# EAGLE design PanoBoardV4 (EAGLE 9.2.2)
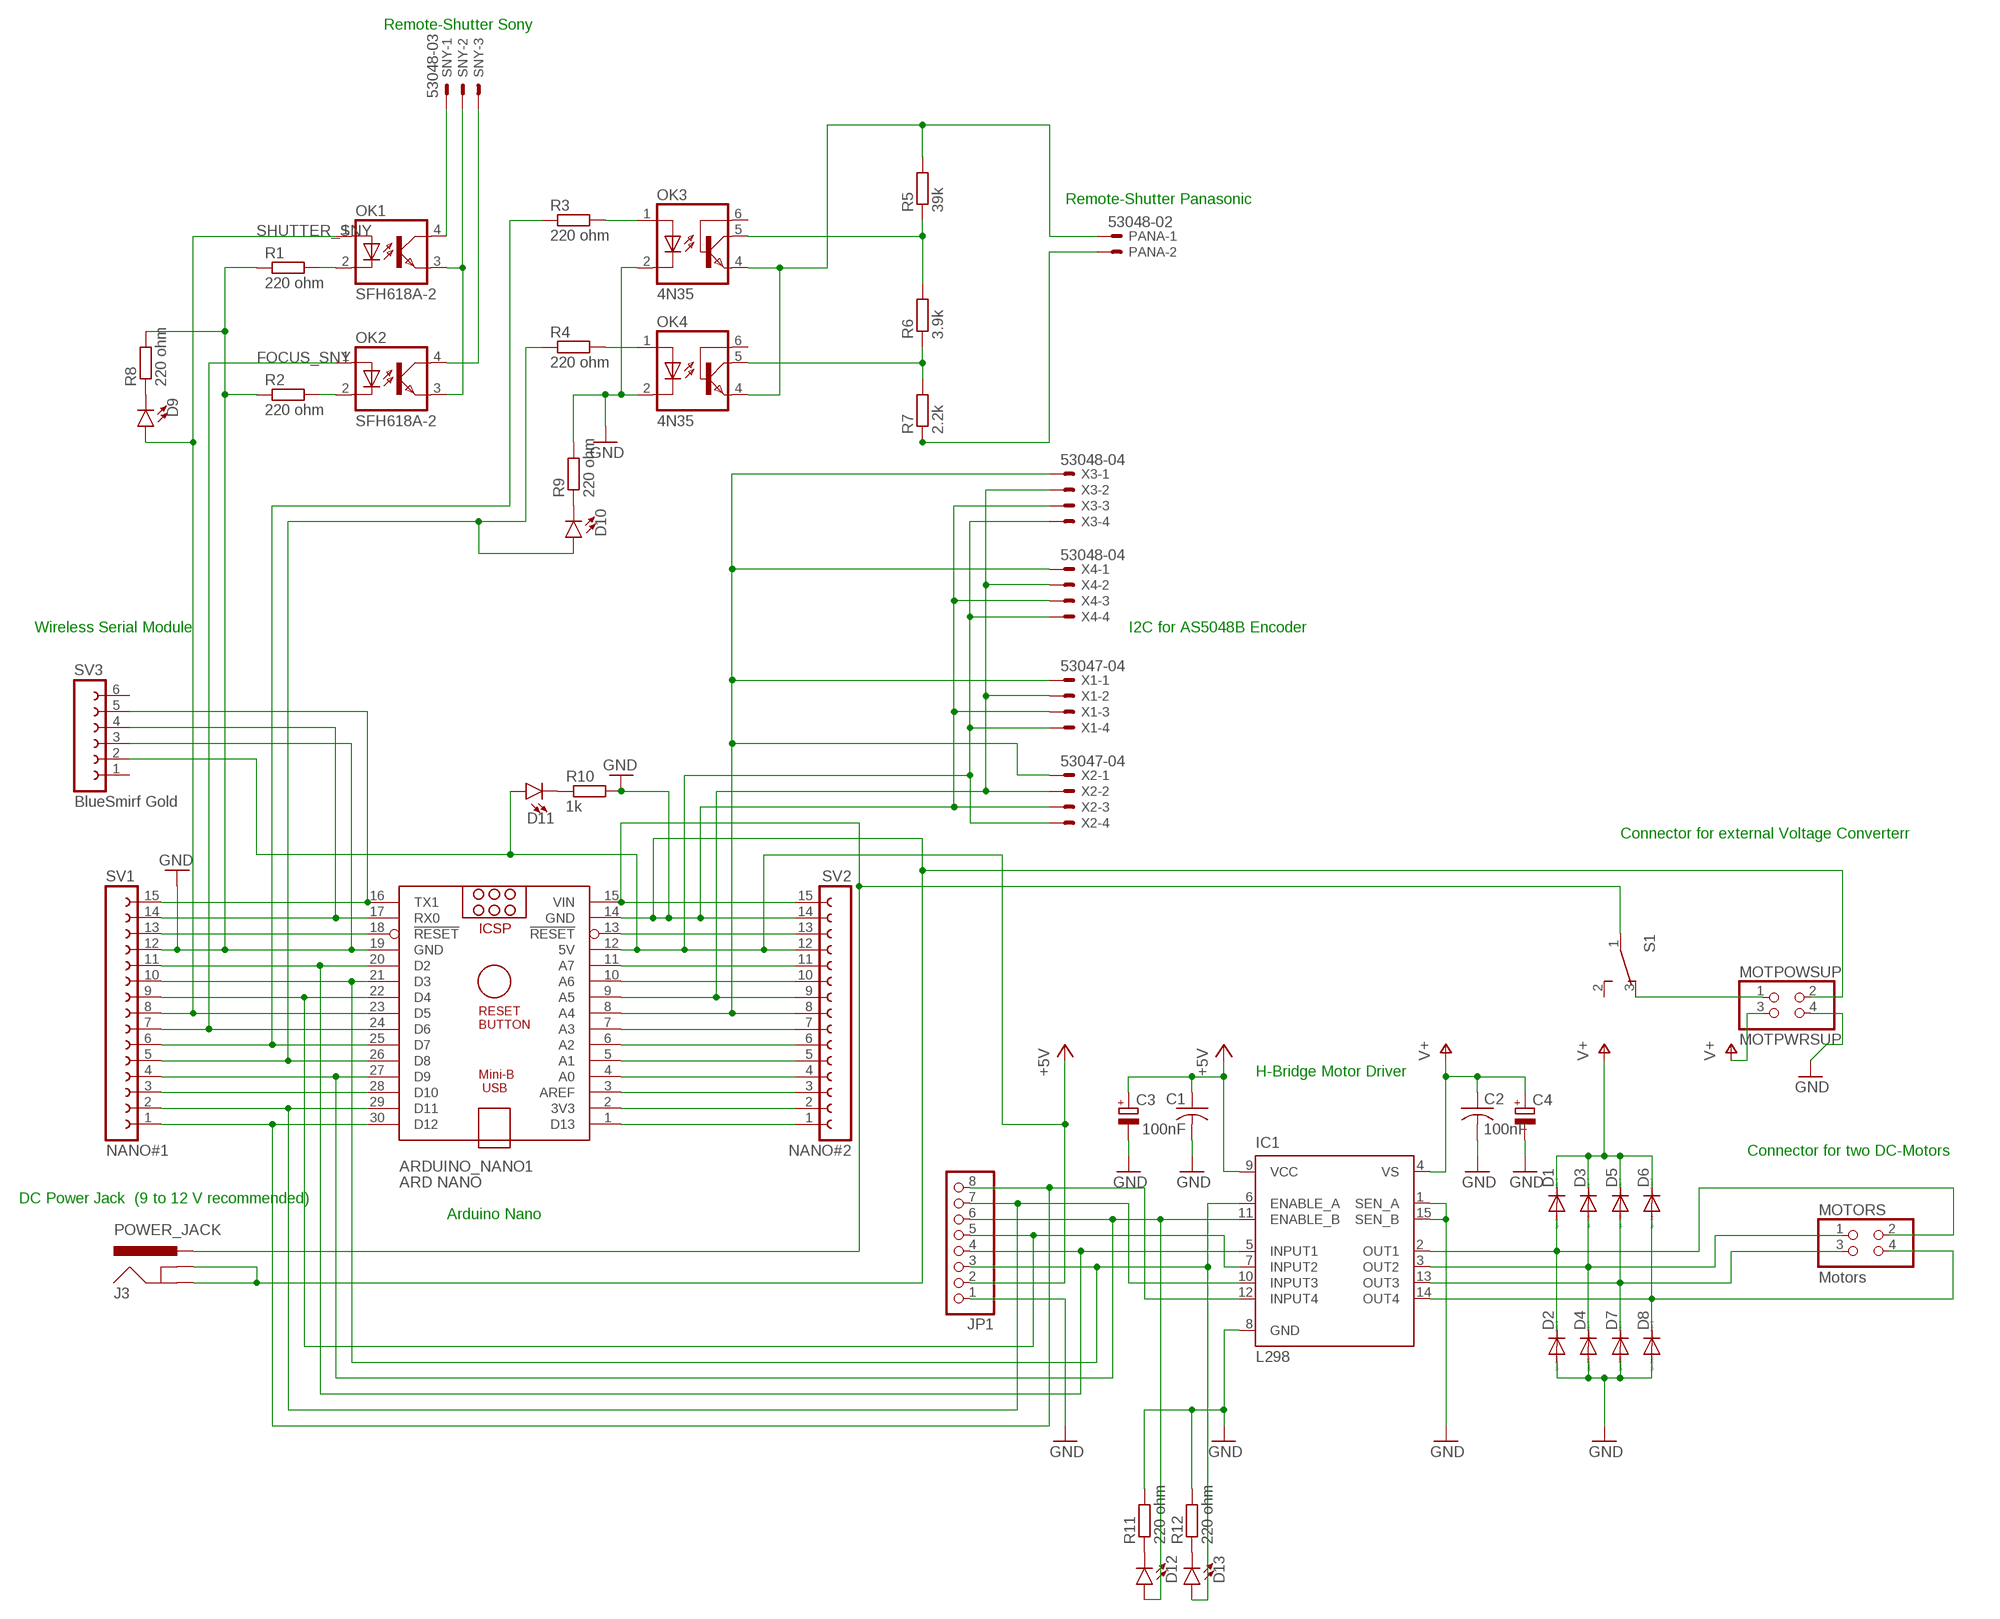
[diagram p0: schematic, sheet 1]

## Parts
ARDUINO_NANO1  ARD NANO  ARDUINO_NANO  [ARDUINO_NANO]
C1  100nF  C-US050-024X044  [C050-024X044]
C2  100nF  C-US050-024X044  [C050-024X044]
C3  CPOL-EUE3.5-10  [E3,5-10]
C4  CPOL-EUE3.5-10  [E3,5-10]
D1  DIODE-D-5  [D-5]
D2  DIODE-D-5  [D-5]
D3  DIODE-D-5  [D-5]
D4  DIODE-D-5  [D-5]
D5  DIODE-D-5  [D-5]
D6  DIODE-D-5  [D-5]
D7  DIODE-D-5  [D-5]
D8  DIODE-D-5  [D-5]
D9  LED1206  [LED-1206]
D10  LED1206  [LED-1206]
D11  LED1206  [LED-1206]
D12  LED1206  [LED-1206]
D13  LED1206  [LED-1206]
IC1  L298  [MULTIWATT-15]
J3  POWER_JACK  [POWER_JACK_PTH]
JP1  PINHD-1X8  [1X08]
MOTORS  Motors  PINHD-2X2  [2X02]
MOTPOWSUP  MOTPWRSUP  PINHD-2X2  [2X02]
OK1  SFH618A-2  [DIP4]
OK2  SFH618A-2  [DIP4]
OK3  4N35  [DIL06]
OK4  4N35  [DIL06]
PANA  53048-02  [53048-02]
R1  220 ohm  R-EU_R1210  [R1210]
R2  220 ohm  R-EU_R1210  [R1210]
R3  220 ohm  R-EU_R1210  [R1210]
R4  220 ohm  R-EU_R1210  [R1210]
R5  39k  R-EU_R1210  [R1210]
R6  3.9k  R-EU_R1210  [R1210]
R7  2.2k  R-EU_R1210  [R1210]
R8  220 ohm  R-EU_R1210  [R1210]
R9  220 ohm  R-EU_R1210  [R1210]
R10  1k  R-EU_R1210  [R1210]
R11  220 ohm  R-EU_R1210  [R1210]
R12  220 ohm  R-EU_R1210  [R1210]
S1  450302014072  [450302014072]
SNY  53048-03  [53048-03]
SV1  NANO#1  FE15-1  [FE15]
SV2  NANO#2  FE15-1  [FE15]
SV3  BlueSmirf Gold  FE06W  [FE06W]
X1  53047-04  [53047-04]
X2  53047-04  [53047-04]
X3  53048-04  [53048-04]
X4  53048-04  [53048-04]

## Nets
+5V [power5v]: ARDUINO_NANO1.12(5V) C1.1 C3.+ D11.A IC1.9(VCC) JP1.2 SV2.12 SV3.2 X1.4 X2.4 X3.4 X4.4
FOCUS_SNY: ARDUINO_NANO1.24(D6) OK2.1(A) SV1.7
GND [power]: ARDUINO_NANO1.14(GND) ARDUINO_NANO1.19(GND) C1.2 C2.2 C3.- C4.- D2.A D4.A D7.A D8.A IC1.1(SEN_A) IC1.8(GND) IC1.15(SEN_B) J3.GND J3.GNDBREAK JP1.1 MOTPOWSUP.2 MOTPOWSUP.4 OK3.2(C) OK4.2(C) R1.1 R2.1 R8.2 R9.2 R10.2 R11.2 R12.2 SV1.12 SV2.14 SV3.3 X1.3 X2.3 X3.3 X4.3
N$1: ARDUINO_NANO1.16(TX1) SV1.15 SV3.5
N$2: ARDUINO_NANO1.17(RX0) SV1.14 SV3.4
N$3: ARDUINO_NANO1.18(!RESET) SV1.13
N$4 [signal]: OK1.2(C) R1.2
N$5: ARDUINO_NANO1.20(D2) IC1.5(INPUT1) JP1.4 SV1.11
N$6: ARDUINO_NANO1.21(D3) D13.A IC1.6(ENABLE_A) JP1.3 SV1.10
N$7: ARDUINO_NANO1.22(D4) IC1.7(INPUT2) JP1.5 SV1.9
N$8 [signal]: OK1.3(EMIT) OK2.3(EMIT) SNY.2
N$9 [signal]: OK1.4(COL) SNY.1
N$10: ARDUINO_NANO1.25(D7) R3.1 SV1.6
N$11: ARDUINO_NANO1.26(D8) D10.A R4.1 SV1.5
N$12: ARDUINO_NANO1.27(D9) D12.A IC1.11(ENABLE_B) JP1.6 SV1.4
N$13: ARDUINO_NANO1.28(D10) SV1.3
N$14: ARDUINO_NANO1.29(D11) IC1.10(INPUT3) JP1.7 SV1.2
N$15: ARDUINO_NANO1.30(D12) IC1.12(INPUT4) JP1.8 SV1.1
N$16 [power]: ARDUINO_NANO1.15(VIN) J3.PWR S1.1 SV2.15
N$17 [signal]: OK2.2(C) R2.2
N$18: ARDUINO_NANO1.13(!RESET) SV2.13
N$19 [signal]: OK3.1(A) R3.2
N$20: ARDUINO_NANO1.11(A7) SV2.11
N$21: ARDUINO_NANO1.10(A6) SV2.10
N$22: ARDUINO_NANO1.9(A5) SV2.9 X1.2 X2.2 X3.2 X4.2
N$23: ARDUINO_NANO1.8(A4) SV2.8 X1.1 X2.1 X3.1 X4.1
N$24: ARDUINO_NANO1.7(A3) SV2.7
N$25: ARDUINO_NANO1.6(A2) SV2.6
N$26: ARDUINO_NANO1.5(A1) SV2.5
N$27: ARDUINO_NANO1.4(A0) SV2.4
N$28: ARDUINO_NANO1.3(AREF) SV2.3
N$29: ARDUINO_NANO1.2(3V3) SV2.2
N$30: ARDUINO_NANO1.1(D13) SV2.1
N$31 [motor]: D1.A D2.C IC1.2(OUT1) MOTORS.2
N$32 [motor]: D3.A D4.C IC1.3(OUT2) MOTORS.1
N$33 [motor]: D6.A D8.C IC1.14(OUT4) MOTORS.4
N$34 [motor]: D5.A D7.C IC1.13(OUT3) MOTORS.3
N$35 [signal]: OK4.1(A) R4.2
N$36 [signal]: OK2.4(COL) SNY.3
N$37 [signal]: OK3.5(COL) R5.1 R6.2
N$38 [signal]: OK3.4(EMI) OK4.4(EMI) PANA.1 R5.2
N$39 [signal]: OK4.5(COL) R6.1 R7.2
N$40 [power]: D9.C R8.1
N$41 [signal]: PANA.2 R7.1
N$42 [power]: D10.C R9.1
N$43 [power]: D11.C R10.1
N$44 [power]: MOTPOWSUP.1 S1.3
N$45 [power]: D12.C R11.1
N$46 [power]: D13.C R12.1
SHUTTER_SNY: ARDUINO_NANO1.23(D5) D9.A OK1.1(A) SV1.8
V+ [power]: C2.1 C4.+ D1.C D3.C D5.C D6.C IC1.4(VS) MOTPOWSUP.3
Unconnected: OK3.6(BAS) OK4.6(BAS) S1.2 SV3.1 SV3.6

## Notes on the sheet
- Remote-Shutter Sony
- Remote-Shutter Panasonic
- Wireless Serial Module | I2C for AS5048B Encoder
- Connector for external Voltage Converterr
- H-Bridge Motor Driver
- Connector for two DC-Motors
- DC Power Jack  (9 to 12 V recommended)
- Arduino Nano

## Library data of the parts
ARDUINO_NANO1 = ArduinoNanoV30:ARDUINO_NANO: Arduino Nano V3.0 Overview: The Arduino Nano is a small, complete, and breadboard-friendly board based on the ATmega328 (Arduino Nano 3.x) or ATmega168 (Arduino Nano 2.x). It has more or less the same functionality of the Arduino Duemilanove, but in a different package. It lacks only a DC power jack, and works with a Mini-B USB cable instead of a standard one. The Nano was designed and is being produced by Gravitech. Specifications: Microcontroller Atmel ATmega168 or ATmega328 Operating Voltage (logic level) 5 V Input Voltage (recommended) 7-12 V Input Voltage (limits) 6-20 V Digital I/O Pins 14 (of which 6 provide PWM output) Analog Input Pins 8 DC Current per I/O Pin 40 mA Flash Memory 16 KB (ATmega168) or 32 KB (ATmega328) of which 2 KB used by bootloader SRAM 1 KB (ATmega168) or 2 KB (ATmega328) EEPROM 512 bytes (ATmega168) or 1 KB (ATmega328) Clock Speed 16 MHz Dimensions 0.73" x 1.70" Length 45 mm Width 18 mm Weigth 5 g Power: The Arduino Nano can be powered via the Mini-B USB connection, 6-20V unregulated external power supply (pin 30), or 5V regulated external power supply (pin 27). The power source is automatically selected to the highest voltage source. Memory: The ATmega168 has 16 KB of flash memory for storing code (of which 2 KB is used for the bootloader); the ATmega328 has 32 KB, (also with 2 KB used for the bootloader). The ATmega168 has 1 KB of SRAM and 512 bytes of EEPROM (which can be read and written with the EEPROM library); the ATmega328 has 2 KB of SRAM and 1 KB of EEPROM. Input and Output: Each of the 14 digital pins on the Nano can be used as an input or output, using pinMode(), digitalWrite(), and digitalRead() functions. They operate at 5 volts. Each pin can provide or receive a maximum of 40 mA and has an internal pull-up resistor (disconnected by default) of 20-50 kOhms. In addition, some pins have specialized functions. Visit Arduino - ArduinoBoardNano <https://www.arduino.cc/en/Main/ArduinoBoardNano>
C1 C2 = rcl:C-US: CAPACITOR, American symbol
C3 C4 = rcl:CPOL-EU: POLARIZED CAPACITOR, European symbol; SPICEPREFIX: C
D1-D8 = diode:DIODE-: DIODE
D9-D13 = SparkFun-LED:LED: LED (Generic) Standard schematic elements and footprints for 5mm, 3mm, 1206, and 0603 sized LEDs. Generic LEDs with no color specified.
IC1 = st-microelectronics:L298: DUAL FULL-BRIDGE DRIVER
J3 = SparkFun-Connectors:POWER_JACK: Power Jack Connector This is the standard 5.5mm barrel jack for power. The PTH is the most common, proven, reliable, footprint. The Slot footprint only works if the mill layer is transmitted to the PCB fab house so be warned. Here are the connectors we sell at SparkFun: DC Barrel Power Jack/Connector <https://www.sparkfun.com/products/119> (PRT-00119) DC Barrel Power Jack/Connector (SMD) <https://www.sparkfun.com/products/12748> (PRT-12748) DC Barrel Jack Adapter - Breadboard Compatible <https://www.sparkfun.com/products/10811> (PRT-10811) It is used on this SparkFun product (and many, many others): SparkFun RedBoard - Programmed with Arduino <https://www.sparkfun.com/products/12757> (DEV-12757) Also, if you need a mating power supply or connector, please check these out: Wall Adapter Power Supply - 9VDC 650mA <https://www.sparkfun.com/products/298> (TOL-00298) DC Barrel Jack Adapter - Male <https://www.sparkfun.com/products/10287> (PRT-10287); PROD_ID: CONN-08197
JP1 = pinhead:PINHD-1X8: PIN HEADER
MOTORS MOTPOWSUP = pinhead:PINHD-2X2: PIN HEADER
OK1 OK2 = optocoupler:SFH618?*: Optocoupler, Phototransistor Output, Low Input Current Source: Data sheet <http://www.vishay.com/docs/83673/sfh618.pdf>; MF: VISHAY/TELEFUNKEN; MPN: SFH618A-2; OC_FARNELL: 6424855; OC_NEWARK: 21H7744
OK3 OK4 = optocoupler:4N35: MOTOROLA OPTO COUPLER; MF: FAIRCHILD SEMICONDUCTOR; MPN: 4N35; OC_FARNELL: 1328375; OC_NEWARK: 72K9946
PANA = con-molex:53?-02: CONNECTOR wire to board 1.25 mm (.049 inch) pitch header; MF: MOLEX; MPN: 53048-0210; OC_FARNELL: 1012259; OC_NEWARK: 57H4718
R1-R12 = rcl:R-EU_: RESISTOR, European symbol; SPICEPREFIX: R
S1 = Eagle_SWITCHES (rev18c):450302014072: 10x2.5 mm THT right angled WS-SLTU <http://katalog.we-online.de/media/images/v2/Family_WS-SLTU_THT_Mini_Slide_Switch_450302014072.jpg> Details see: http://katalog.we-online.de/en/em/SLTU_10X2_5_THT_RIGHT_ANGLED 2015 (C) Wurth Elektronik
SNY = con-molex:53?-03: CONNECTOR wire to board 1.25 mm (.049 inch) pitch header; MF: WALDOM/MOLEX; MPN: 53048-0310; OC_FARNELL: 9732918; OC_NEWARK: 38C9908
SV1 SV2 = con-lsta:FE15-1: FEMALE HEADER; OC_FARNELL: unknown; OC_NEWARK: unknown
SV3 = con-lsta:FE06W: FEMALE HEADER; OC_FARNELL: unknown; OC_NEWARK: unknown
X1 X2 = con-molex:53?-04: CONNECTOR wire to board 1.25 mm (.049 inch) pitch header; MF: WALDOM/MOLEX; MPN: 53047-0410; OC_FARNELL: 9733060; OC_NEWARK: 38C9900
X3 X4 = con-molex:53?-04: CONNECTOR wire to board 1.25 mm (.049 inch) pitch header; MF: MOLEX; MPN: 53048-0410; OC_FARNELL: 1462887; OC_NEWARK: 57H4721

## Net classes
0 default: width 0.508 mm, drill 0.254 mm, clearance 0.254 mm
1 power: width 1.27 mm, drill 0.635 mm, clearance 0.254 mm
2 signal: width 0.508 mm, drill 0.254 mm, clearance 0.254 mm
3 power5v: width 0.889 mm, drill 0.508 mm, clearance 0.254 mm
4 motor: width 1.016 mm, drill 0.508 mm, clearance 0.254 mm

## Board
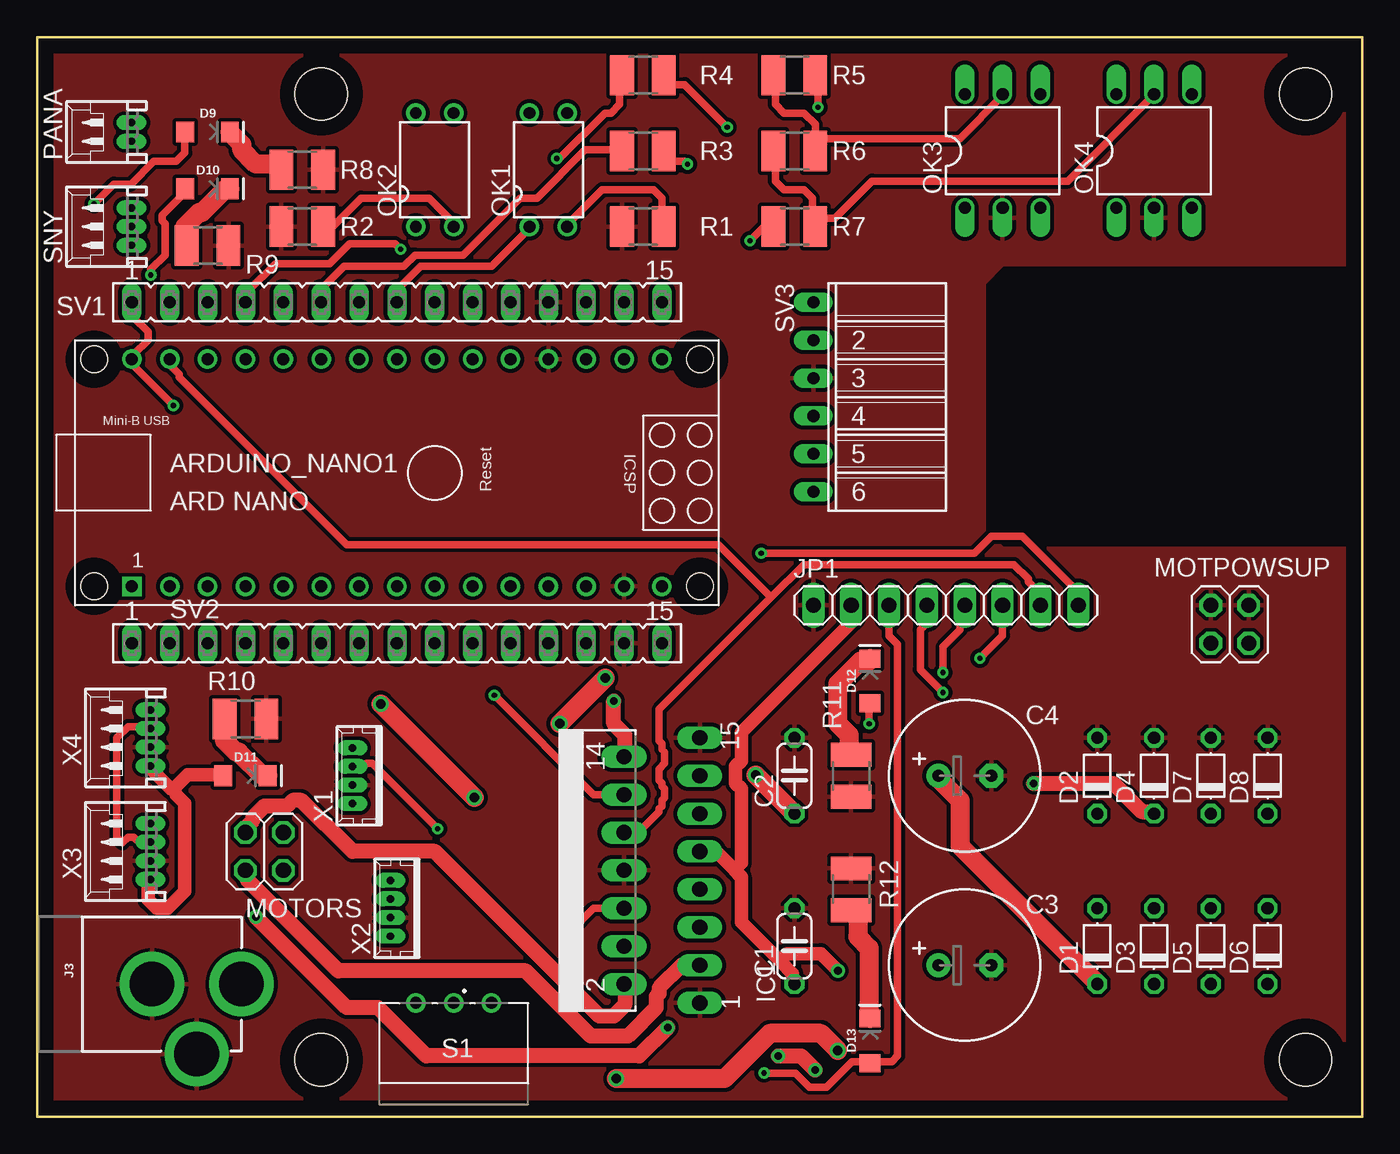
[diagram p1: board, top side]
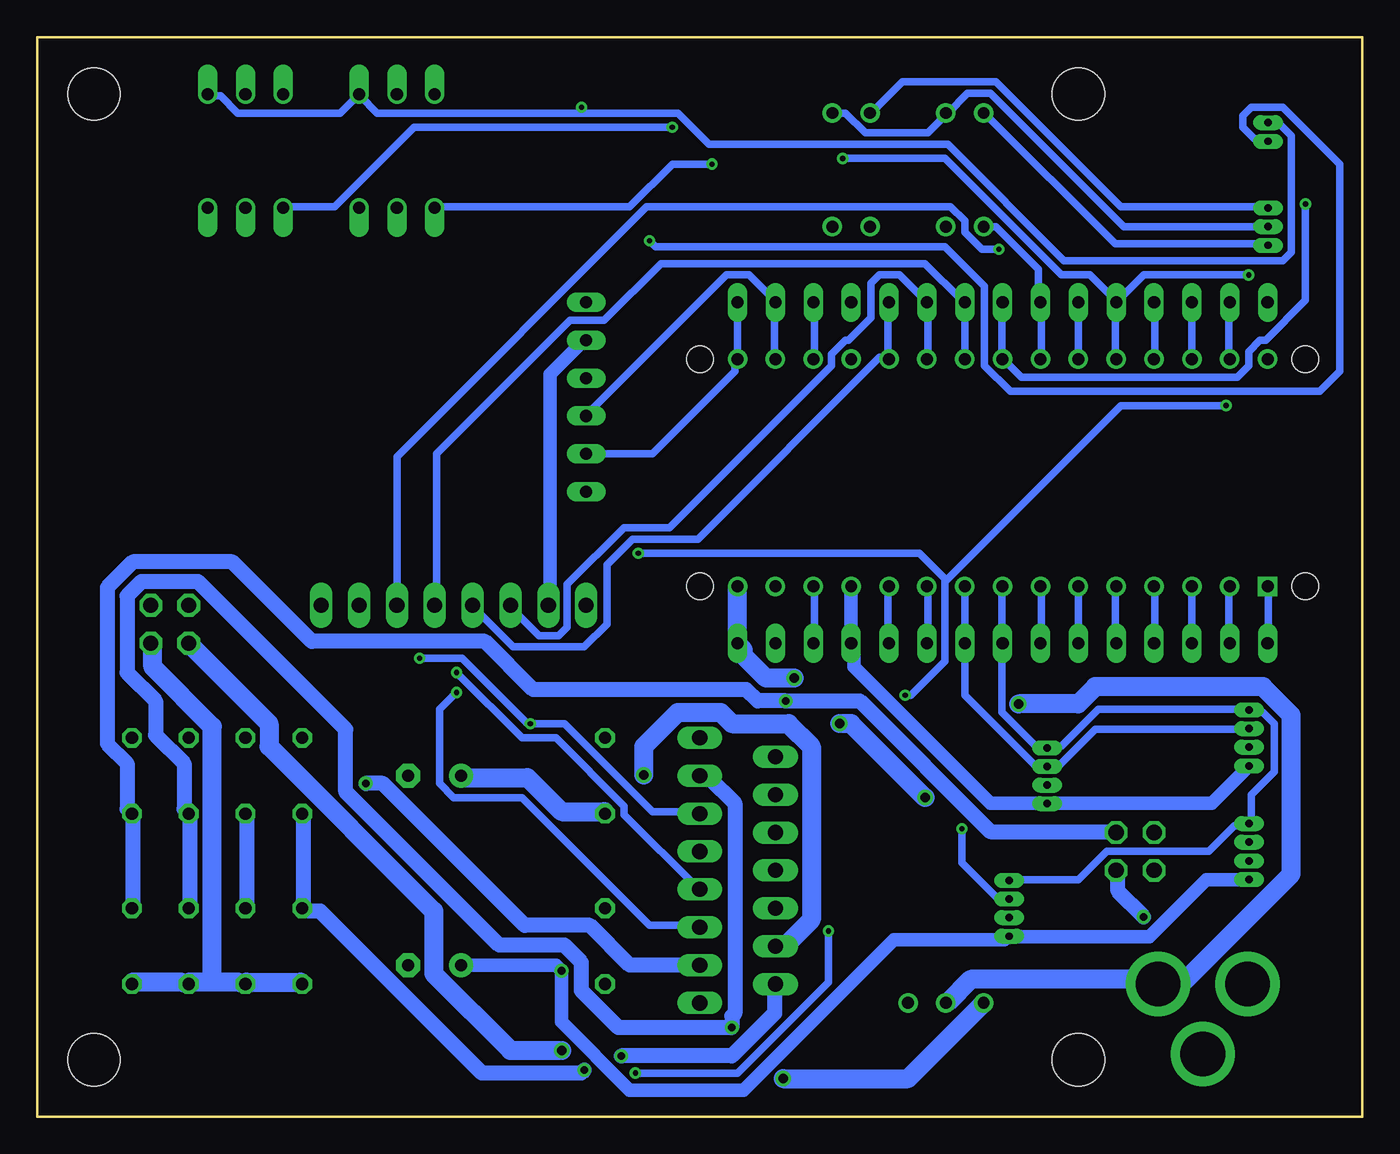
[diagram p2: board, bottom side, seen from below]

Size 88.9 x 72.39 mm. Coordinates in mm from the lower left corner, seen from the top.
Outline: 0,0 0,72.39 88.9,72.39 88.9,0 0,0
Copper layers (1*16): Top 0.035mm / dielectric 1.5mm / Bottom 0.035mm
Design rules "default": minimum track width 6mil, minimum drill 0.35mm, track to track 6mil, track to pad 6mil, pad to pad 6mil, via to via 6mil, smd to smd 6mil, copper to edge 40mil, drill to drill 6mil, minimum pad ring 10mil, minimum via ring 8mil, stop-mask expansion 4mil, vias tented up to drill 0mil, thermal gap 10mil
Holes 3.5 mm at 19.05,68.58 19.05,3.81 85.09,68.58 85.09,3.81

### Footprints (pad centres in the part's own frame; a part is rotated, then mirrored left to right if it is on the bottom)
ARDUINO_NANO = drill 0.8 square: 1 -20.32,-7.62 | drill 0.8: 2 -17.78,-7.62; 3 -15.24,-7.62; 4 -12.7,-7.62; 5 -10.16,-7.62; 6 -7.62,-7.62; 7 -5.08,-7.62; 8 -2.54,-7.62; 9 0,-7.62; 10 2.54,-7.62; 11 5.08,-7.62; 12 7.62,-7.62; 13 10.16,-7.62; 14 12.7,-7.62; 15 15.24,-7.62; 16 15.24,7.62; 17 12.7,7.62; 18 10.16,7.62; 19 7.62,7.62; 20 5.08,7.62; 21 2.54,7.62; 22 0,7.62; 23 -2.54,7.62; 24 -5.08,7.62; 25 -7.62,7.62; 26 -10.16,7.62; 27 -12.7,7.62; 28 -15.24,7.62; 29 -17.78,7.62; 30 -20.32,7.62 | hole 1.778: -22.86,-7.62; -22.86,7.62; 17.78,7.62; 17.78,-7.62
C050-024X044 = drill 0.813 octagon: 1 -2.54,0; 2 2.54,0
E3,5-10 = drill 0.813 pad 1.6: + -1.778,0 | drill 0.813 pad 1.6 octagon: - 1.778,0
D-5 = drill 0.813 octagon: A 2.54,0; C -2.54,0
LED-1206 = smd 1.2 x 1.4: A -1.5,0; C 1.5,0
MULTIWATT-15 = drill 1.016 long: 1 -8.89,-7.62; 2 -7.62,-2.54; 3 -6.35,-7.62; 4 -5.08,-2.54; 5 -3.81,-7.62; 6 -2.54,-2.54; 7 -1.27,-7.62; 8 0,-2.54; 9 1.27,-7.62; 10 2.54,-2.54; 11 3.81,-7.62; 12 5.08,-2.54; 13 6.35,-7.62; 14 7.62,-2.54; 15 8.89,-7.62
POWER_JACK_PTH = drill 2.997 pad 4.318: GND 0,7.7; GNDBREAK 4.7,10.7; PWR 0,13.7
1X08 = drill 1.016 long: 1 -8.89,0; 2 -6.35,0; 3 -3.81,0; 4 -1.27,0; 5 1.27,0; 6 3.81,0; 7 6.35,0; 8 8.89,0
2X02 = drill 1.016 octagon: 1 -1.27,-1.27; 2 -1.27,1.27; 3 1.27,-1.27; 4 1.27,1.27
DIP4 = drill 0.8: 1 -1.27,-3.81; 2 1.27,-3.81; 3 1.27,3.81; 4 -1.27,3.81
DIL06 = drill 0.813 offset: 1 -2.54,-3.81; 2 0,-3.81; 3 2.54,-3.81; 4 2.54,3.81; 5 0,3.81; 6 -2.54,3.81
53048-02 = drill 0.5 pad 0.698 long: 1 0.625,-1.25; 2 -0.625,-1.25
R1210 = smd 1.6 x 2.7: 1 -1.4,0; 2 1.4,0
450302014072 = drill 0.8: 1 0,0; 2 -2.54,0; 3 2.54,0
53048-03 = drill 0.5 pad 0.698 long: 1 1.25,-1.25; 2 0,-1.25; 3 -1.25,-1.25
FE15 = drill 0.813 long: 1 -17.78,0; 2 -15.24,0; 3 -12.7,0; 4 -10.16,0; 5 -7.62,0; 6 -5.08,0; 7 -2.54,0; 8 0,0; 9 2.54,0; 10 5.08,0; 11 7.62,0; 12 10.16,0; 13 12.7,0; 14 15.24,0; 15 17.78,0
FE06W = drill 0.813 long: 1 -6.35,0; 2 -3.81,0; 3 -1.27,0; 4 1.27,0; 5 3.81,0; 6 6.35,0
53047-04 = drill 0.5 pad 0.698 long: 1 1.875,0.45; 2 0.625,0.45; 3 -0.625,0.45; 4 -1.875,0.45
53048-04 = drill 0.5 pad 0.698 long: 1 1.875,-1.25; 2 0.625,-1.25; 3 -0.625,-1.25; 4 -1.875,-1.25

### Placement (x,y rotation side)
ARDUINO_NANO1  26.67,43.18 0 top
C1  50.8,11.43 90 top
C2  50.8,22.86 90 top
C3  62.23,10.16 0 top
C4  62.23,22.86 0 top
D1  71.12,11.43 90 top
D2  71.12,22.86 90 top
D3  74.93,11.43 90 top
D4  74.93,22.86 90 top
D5  78.74,11.43 90 top
D6  82.55,11.43 90 top
D7  78.74,22.86 90 top
D8  82.55,22.86 90 top
D9  11.43,66.04 0 top
D10  11.43,62.23 0 top
D11  13.97,22.86 0 top
D12  55.88,29.21 90 top
D13  55.88,5.08 90 top
IC1  36.83,16.51 90 top
J3  0,8.89 270 top
JP1  60.96,34.29 0 top
MOTORS  15.24,17.78 0 top
MOTPOWSUP  80.01,33.02 0 top
OK1  34.29,63.5 0 top
OK2  26.67,63.5 0 top
OK3  64.77,64.77 0 top
OK4  74.93,64.77 0 top
PANA  5.08,66.04 90 top
R1  40.64,59.69 0 top
R2  17.78,59.69 0 top
R3  40.64,64.77 0 top
R4  40.64,69.85 0 top
R5  50.8,69.85 0 top
R6  50.8,64.77 0 top
R7  50.8,59.69 0 top
R8  17.78,63.5 0 top
R9  11.43,58.42 0 top
R10  13.97,26.67 0 top
R11  54.61,22.86 270 top
R12  54.61,15.24 90 top
S1  27.94,7.62 180 top
SNY  5.08,59.69 90 top
SV1  24.13,54.61 0 top
SV2  24.13,31.75 0 top
SV3  52.07,48.26 270 top
X1  21.59,22.86 90 top
X2  24.13,13.97 90 top
X3  6.35,17.78 90 top
X4  6.35,25.4 90 top

### Tracks (layer width: path | path; a pad name or v marks a point on that pad's centre or on a via)
+5V  (via drill 0.51)
  Top 0.889: 9.14,21.97 10.1,22.92 12.38,22.92 D11.A | 9.14,21.97 8.95,21.97 7.43,23.5 X4.4 | X3.4 7.43,15.88 7.43,14.54 8,13.97 8.76,13.97 9.91,15.11 9.91,21.02 9.34,21.59 9.14,21.97 | 49.82,10.45 47.24,13.02 47.24,16.07 46.77,16.54 | 49.82,10.45 50.67,9.59 50.67,9.02 C1.1 | 46.77,16.54 45.53,17.78 IC1.9 | v53.72,9.78 52.58,10.92 50.29,10.92 49.82,10.45 | JP1.2 54.48,34.16 54.48,33.02 47.24,25.78 47.24,23.88 46.86,23.5 46.86,22.35 47.24,21.97 47.24,17.02 46.77,16.54
  Bottom 0.889: X3.4 7.62,15.88 10.48,15.88 14.29,12.07 23.62,12.07 X2.4 24,11.88 31.43,11.88 41.53,1.78 49.15,1.78 53.72,6.35 v53.72,9.78 54.1,10.16 C3.+ | ARDUINO_NANO1.12 SV2.12 34.1,31.5 34.1,30.16 24.96,21.02 21.53,21.02 X1.4 20.95,21.02 10.1,21.02 7.62,23.5 X4.4 | SV3.2 52.2,52.07 54.48,49.78 54.48,34.35 JP1.2
FOCUS_SNY
  Bottom 0.508: ARDUINO_NANO1.24 21.53,50.93 21.53,54.55 SV1.7 21.72,54.74 21.72,56.83 24.57,59.69 OK2.1
GND
  pour Top: 0,72.39 88.9,72.39 88.9,57.15 64.77,57.15 63.5,55.88 63.5,39.37 64.77,38.1 88.9,38.1 88.9,0 0,0
N$1
  Bottom 0.508: SV1.15 ARDUINO_NANO1.16 42.1,50.74 42.1,49.97 47.62,44.45 SV3.5
N$2
  Bottom 0.508: ARDUINO_NANO1.17 39.43,50.93 39.43,54.55 SV1.14 39.43,54.74 41.15,56.45 42.67,56.45 52.01,47.12 SV3.4
N$3
  Bottom 0.508: ARDUINO_NANO1.18 36.77,50.93 36.77,54.55 SV1.13
N$4
  Top 0.508: OK1.2 35.62,59.69 35.62,59.88 37.91,62.17 41.34,62.17 41.91,61.59 41.91,59.69 R1.2
N$5  (via drill 0.35)
  Top 0.508: v60.77,28.45 59.24,29.97 59.24,32.64 59.63,33.02 59.63,34.16 JP1.4
  Bottom 0.508: SV1.11 31.81,54.55 31.81,50.93 ARDUINO_NANO1.20 32,50.93 32.38,50.93 44.58,38.73 48.96,38.73 50.67,37.02 50.67,33.02 52.2,31.5 56.96,31.5 59.63,34.16 JP1.4 | v60.77,28.45 61.91,27.3 61.91,22.35 60.96,21.4 56.39,21.4 47.82,12.83 44.58,12.83 IC1.5
N$6  (via drill 0.35)
  Top 0.508: JP1.3 57.15,32.26 57.72,31.69 57.72,4.06 57.34,3.68 56.01,3.68 D13.A 55.82,3.68 54.67,3.68 52.96,1.97 51.82,1.97 50.86,2.92 v48.77,2.92 | IC1.6 37.34,13.97 v35.81,12.45
  Bottom 0.508: ARDUINO_NANO1.21 29.15,50.93 29.15,54.55 SV1.10 31.05,56.45 32.38,56.45 32.96,55.88 32.96,53.59 34.48,52.07 34.67,52.07 35.62,51.12 35.62,50.36 46.48,39.5 49.53,39.5 53.34,35.69 53.34,32.83 53.91,32.26 55.24,32.26 57.15,34.16 JP1.3 | v35.81,12.45 35.81,9.02 41.91,2.92 v48.77,2.92
N$7  (via drill 0.35)
  Top 0.508: v60.77,29.78 60.77,31.5 61.91,32.64 61.91,32.83 62.1,33.02 62.1,34.16 JP1.5
  Bottom 0.508: ARDUINO_NANO1.22 SV1.9 26.86,54.74 29.34,57.21 47.05,57.21 50.86,53.4 53.15,53.4 62.1,44.45 62.1,34.35 JP1.5 | v60.77,29.78 56.39,25.4 54.1,25.4 49.53,20.83 49.53,20.26 44.58,15.3 IC1.7
N$8
  Bottom 0.508: SNY.2 16,59.69 24.96,68.64 26.48,68.64 27.81,67.31 OK2.3 28,67.12 29.15,65.98 33.34,65.98 34.67,67.31 OK1.3
N$9
  Bottom 0.508: SNY.1 6.48,61.02 16.19,61.02 24.57,69.41 30.86,69.41 32.96,67.31 OK1.4
N$10
  Top 0.508: SV1.6 19.05,55.5 20.57,57.02 24.57,57.02 25.34,57.78 28.57,57.78 32.38,61.59 33.53,61.59 36.77,64.83 39.05,64.83 R3.1
  Bottom 0.508: SV1.6 ARDUINO_NANO1.25
N$11  (via drill 0.35)
  Top 0.508: v7.62,56.45 7.62,56.83 8.57,57.78 8.57,59.88 8.38,60.07 8.38,60.45 9.91,61.98 9.91,62.17 D10.A | v34.86,64.26 35.05,64.26 38.1,67.31 38.48,67.31 39.05,67.88 39.05,69.79 R4.1
  Bottom 0.508: v7.62,56.45 14.67,56.45 SV1.5 | ARDUINO_NANO1.26 16.57,50.93 16.57,54.55 SV1.5 | v34.86,64.26 28,64.26 20.19,56.45 18.29,56.45 16.57,54.74 SV1.5
N$12  (via drill 0.35)
  Top 0.508: v55.82,26.35 55.82,27.69 D12.A | JP1.6 64.77,32.26 v63.25,30.73 | v24.38,58.17 24,58.55 20.95,58.55 19.62,57.21 16,57.21 14.1,55.31 14.1,54.74 SV1.4
  Bottom 0.508: ARDUINO_NANO1.27 13.91,50.93 13.91,54.55 SV1.4 | IC1.11 44.58,20.45 47.62,20.45 53.53,26.35 v55.82,26.35 56.01,26.35 60.39,30.73 v63.25,30.73 | v24.38,58.17 25.53,58.17 26.67,59.31 26.67,60.07 27.62,61.02 48.01,61.02 64.77,44.26 JP1.6
N$13
  Bottom 0.508: SV1.3 ARDUINO_NANO1.28
N$14
  Top 0.508: 49.24,34.83 51.44,37.02 65.53,37.02 66.48,36.07 66.48,35.88 67.25,35.12 67.25,34.35 JP1.7 | 49.24,34.83 41.72,27.3 41.72,25.21 41.91,25.02 41.91,24.64 42.1,24.45 42.1,23.69 41.72,23.3 41.72,22.54 41.91,22.35 41.91,22.16 42.1,21.97 42.1,21.4 41.91,21.21 41.91,20.83 41.72,20.64 41.72,20.45 40.39,19.11 39.43,19.11 IC1.10 | 49.24,34.83 45.72,38.35 20.77,38.35 9.53,49.59 9.53,49.78 8.95,50.36 8.95,50.74 ARDUINO_NANO1.29
  Bottom 0.508: ARDUINO_NANO1.29 8.95,50.93 8.95,54.55 SV1.2
N$15  (via drill 0.35)
  Top 0.508: SV1.1 6.48,54.55 6.48,53.59 7.43,52.64 7.43,52.07 6.48,51.12 6.48,50.93 ARDUINO_NANO1.30 6.48,50.74 6.48,50.36 v9.14,47.69 | IC1.12 37.34,21.59 v30.67,28.26 | v48.58,37.78 62.87,37.78 64.01,38.93 66.1,38.93 69.72,35.31 69.72,34.35 JP1.8
  Bottom 0.508: v30.67,28.26 30.29,28.26 28,30.54 28,35.88 | 28,35.88 16.19,47.69 v9.14,47.69 | v48.58,37.78 29.72,37.78 28,36.07 28,35.88
N$16  (via drill 0.64)
  Top 1.27: v35.05,26.35 v38.1,29.4 | v23.05,27.69 v29.34,21.4
  Bottom 1.27: ARDUINO_NANO1.15 SV2.15 41.53,31.31 41.53,30.92 40.01,29.4 v38.1,29.4 | S1.1 27.81,7.68 26.29,9.21 13.91,9.21 13.72,9.02 J3.PWR 13.14,9.21 11.81,9.21 4.76,16.26 4.76,26.92 6.67,28.83 17.91,28.83 19.05,27.69 v23.05,27.69 | v35.05,26.35 34.29,26.35 v29.34,21.4
N$17
  Top 0.508: R2.2 19.81,59.69 21.72,61.59 26.29,61.59 27.81,60.07 27.81,59.69 OK2.2
N$18
  Bottom 0.508: ARDUINO_NANO1.13 36.77,35.5 36.77,31.88 SV2.13
N$19  (via drill 0.35)
  Top 0.508: v43.62,63.88 43.43,64.07 42.67,64.07 42.1,64.64 R3.2
  Bottom 0.508: v43.62,63.88 46.29,63.88 49.15,61.02 62.1,61.02 OK3.1
N$20
  Bottom 0.508: ARDUINO_NANO1.11 31.81,35.5 31.81,31.88 SV2.11
N$21
  Bottom 0.508: ARDUINO_NANO1.10 29.15,35.5 29.15,31.88 SV2.10
N$22  (via drill 0.35)
  Top 0.508: X3.2 7.43,18.35 6.86,18.35 6.48,18.73 6.1,18.73 5.71,18.35 5.33,18.73 5.33,25.4 6.1,26.16 6.67,26.16 6.86,25.97 7.43,25.97 X4.2 | v26.86,19.3 22.48,23.69 22.1,23.69 21.91,23.5 21.14,23.5 X1.2
  Bottom 0.508: v26.86,19.3 26.86,17.02 24.57,14.73 23.81,14.73 X2.2 | ARDUINO_NANO1.9 SV2.9 26.67,28.26 21.91,23.5 21.14,23.5 X1.2 20.95,23.5 20.38,23.5 17.91,25.97 7.62,25.97 X4.2
N$23
  Bottom 0.508: ARDUINO_NANO1.8 24.19,35.5 24.19,31.88 SV2.8 24.19,31.69 24.19,27.11 21.91,24.83 21.14,24.83 X1.1 20.95,24.83 20.19,24.83 17.72,27.3 7.81,27.3 X4.1 7.43,27.11 6.67,27.11 5.91,26.35 5.91,23.11 7.43,21.59 7.43,19.68 X3.1 7.81,19.5 8.57,19.5 10.29,17.78 17.14,17.78 19.05,15.88 23.62,15.88 X2.1
N$24
  Bottom 0.508: ARDUINO_NANO1.7 21.53,35.5 21.53,31.88 SV2.7
N$25
  Bottom 0.508: SV2.6 ARDUINO_NANO1.6
N$26
  Bottom 0.508: ARDUINO_NANO1.5 16.57,35.5 16.57,31.88 SV2.5
N$27
  Bottom 0.508: ARDUINO_NANO1.4 13.91,35.5 13.91,31.88 SV2.4
N$28
  Bottom 0.508: SV2.3 ARDUINO_NANO1.3
N$29
  Bottom 0.508: ARDUINO_NANO1.2 8.95,35.5 8.95,31.88 SV2.2
N$30
  Bottom 0.508: ARDUINO_NANO1.1 6.29,35.5 6.29,31.88 SV2.1
N$31  (via drill 0.51)
  Top 1.016: MOTORS.2 13.91,19.11 13.91,19.3 14.48,19.88 14.48,20.07 15.24,20.83 16.76,20.83 17.14,21.21 17.72,21.21 21.14,17.78 26.67,17.78 37.72,6.73 38.67,6.73 39.43,7.49 39.43,8.83 IC1.2 | v52.2,3.11 51.24,4.06 v49.72,4.06
  Bottom 1.016: D2.C 71.06,20.26 71.06,13.97 D1.A 70.67,13.78 69.91,13.78 59.05,2.92 52.39,2.92 v52.2,3.11 | v49.72,4.06 42.29,4.06 39.43,6.92 39.43,8.83 IC1.2
N$32  (via drill 0.51)
  Top 1.016: IC1.3 43.24,10.16 41.72,8.64 41.72,8.26 41.53,8.07 41.53,7.3 39.62,5.4 37.15,5.4 32.77,9.78 20.19,9.78 14.1,15.88 14.1,16.45 MOTORS.1 | v66.86,22.35 72.2,22.35 74.11,20.45 74.87,20.45 D4.C
  Bottom 1.016: D3.A 74.87,13.97 74.87,20.26 D4.C | v66.86,22.35 65.72,22.35 56.2,12.83 51.82,12.83 49.15,10.16 IC1.3
N$33  (via drill 0.51)
  Top 1.016: v38.67,27.88 38.67,26.35 39.43,25.59 39.43,24.26 IC1.14
  Bottom 1.016: D6.A 82.49,13.97 82.49,20.26 D8.C 82.87,20.64 82.87,23.69 84.2,25.02 84.2,35.5 82.49,37.21 75.82,37.21 70.48,31.88 58.86,31.88 55.63,28.64 41.34,28.64 40.58,27.88 v38.67,27.88 33.72,27.88 24.96,19.11 16.57,19.11 MOTORS.4
N$34  (via drill 0.51)
  Top 1.016: v14.67,13.4 20.77,7.3 22.86,7.3 26.1,4.06 40.39,4.06 v42.29,5.97
  Bottom 1.016: D5.A 78.68,13.97 78.68,20.26 D7.C 79.06,20.64 79.06,23.69 80.96,25.59 80.96,27.88 82.87,29.78 82.87,34.92 81.92,35.88 78.11,35.88 68.2,25.97 68.2,21.78 57.91,11.49 53.53,11.49 52.39,10.35 52.39,8.45 49.91,5.97 v42.29,5.97 42.29,6.73 42.1,6.92 42.1,21.02 43.81,22.73 44.39,22.73 IC1.13 | v14.67,13.4 16.38,15.11 16.38,16.45 MOTORS.3
N$35  (via drill 0.35)
  Top 0.508: v46.29,66.36 43.43,69.22 42.67,69.22 42.1,69.79 R4.2
  Bottom 0.508: v46.29,66.36 63.63,66.36 68.96,61.02 72.39,61.02 OK4.1
N$36
  Bottom 0.508: SNY.3 6.48,58.55 16.57,58.55 25.34,67.31 OK2.4
N$37
  Top 0.508: OK3.5 64.77,68.45 61.91,65.59 52.77,65.59 52.39,65.21 52.39,64.83 R6.2 52.58,65.59 52.2,65.98 52.2,66.55 51.44,67.31 50.1,67.31 49.53,67.88 49.53,69.79 R5.1
N$38  (via drill 0.35)
  Top 0.508: v52.39,67.69 52.39,69.79 R5.2
  Bottom 0.508: 52.39,67.31 66.1,67.31 67.25,68.45 OK3.4 68.58,67.31 75.44,67.31 76.58,68.45 77.34,68.45 OK4.4 | 52.39,67.31 45.91,67.31 43.81,65.21 27.81,65.21 20,57.4 5.33,57.4 4.76,57.97 4.76,65.79 5.52,66.55 6.29,66.55 PANA.1 | v52.39,67.69 52.39,67.31
N$39
  Top 0.508: OK4.5 74.87,68.45 69.15,62.74 56.01,62.74 53.53,60.26 52.77,60.26 R7.2 52.58,60.26 52.01,60.83 52.01,61.59 51.44,62.17 50.1,62.17 49.53,62.74 49.53,64.64 R6.1
N$40
  Top 1.27: D9.C 12.95,65.98 13.72,65.21 13.72,64.83 14.67,63.88 16.19,63.88 16.38,63.69 R8.1
N$41  (via drill 0.35)
  Top 0.508: v47.82,58.74 48.77,59.69 R7.1
  Bottom 0.508: v47.82,58.74 47.43,58.36 28,58.36 25.34,55.69 25.34,50.36 23.62,48.64 2.86,48.64 1.52,49.97 1.52,63.88 5.33,67.69 7.43,67.69 8,67.12 8,66.36 7.24,65.59 6.48,65.59 PANA.2
N$42
  Top 1.27: D10.C 12.76,62.17 12.57,62.17 11.05,60.64 10.86,60.64 9.91,59.69 9.91,58.55 R9.1
N$43
  Top 1.27: D11.C 15.43,22.92 15.05,22.92 13.53,24.45 13.34,24.45 12.57,25.21 12.57,26.54 R10.1
N$44  (via drill 0.64)
  Top 1.27: v38.86,2.54 46.1,2.54 49.15,5.59 52.58,5.59 v53.72,4.45
  Bottom 1.27: S1.3 30.48,2.54 v38.86,2.54 | v53.72,4.45 57.15,4.45 62.29,9.59 62.29,13.78 73.34,24.83 73.34,26.35 MOTPOWSUP.1
N$45
  Top 1.27: D12.C 55.82,30.54 55.24,30.54 53.72,29.02 53.72,26.35 54.48,25.59 54.48,24.45 R11.1
N$46
  Top 1.27: D13.C 55.82,6.73 55.82,11.3 55.05,12.07 55.05,13.59 54.67,13.97 R12.1
SHUTTER_SNY  (via drill 0.35)
  Top 0.508: OK1.1 32.96,59.69 32.96,59.5 30.48,57.02 25.72,57.02 24.19,55.5 24.19,54.74 SV1.8 | v3.81,61.21 5.14,62.55 6.29,62.55 7.81,64.07 9.34,64.07 9.91,64.64 9.91,65.98 D9.A
  Bottom 0.508: v3.81,61.21 3.81,54.74 6.48,52.07 6.86,52.07 7.62,51.31 7.62,50.36 8.38,49.59 22.86,49.59 24,50.74 ARDUINO_NANO1.23 24.19,50.93 24.19,54.55 SV1.8
V+  (via drill 0.64)
  Top 1.27: C2.1 v48.2,22.92 | D1.C 71.06,9.02 61.91,18.16 61.91,21.21 60.39,22.73 C4.+
  Bottom 1.27: D1.C 71.25,9.02 74.87,9.02 D3.C 75.44,9.02 77.15,9.02 | 77.15,9.02 78.68,9.02 D5.C 79.25,9.02 82.49,9.02 D6.C | 77.15,9.02 77.15,26.16 81.15,30.16 81.15,31.69 MOTPOWSUP.3 | C2.1 50.86,20.45 53.72,20.45 56.01,22.73 60.39,22.73 C4.+ | v48.2,22.92 48.2,24.83 45.91,27.11 43.05,27.11 42.29,26.35 38.48,26.35 36.96,24.83 36.96,13.21 38.67,11.49 39.24,11.49 IC1.4

### Text on the board
tCream: CarrierBoardV4